# Altium project LoRa_MIET.PrjPcb
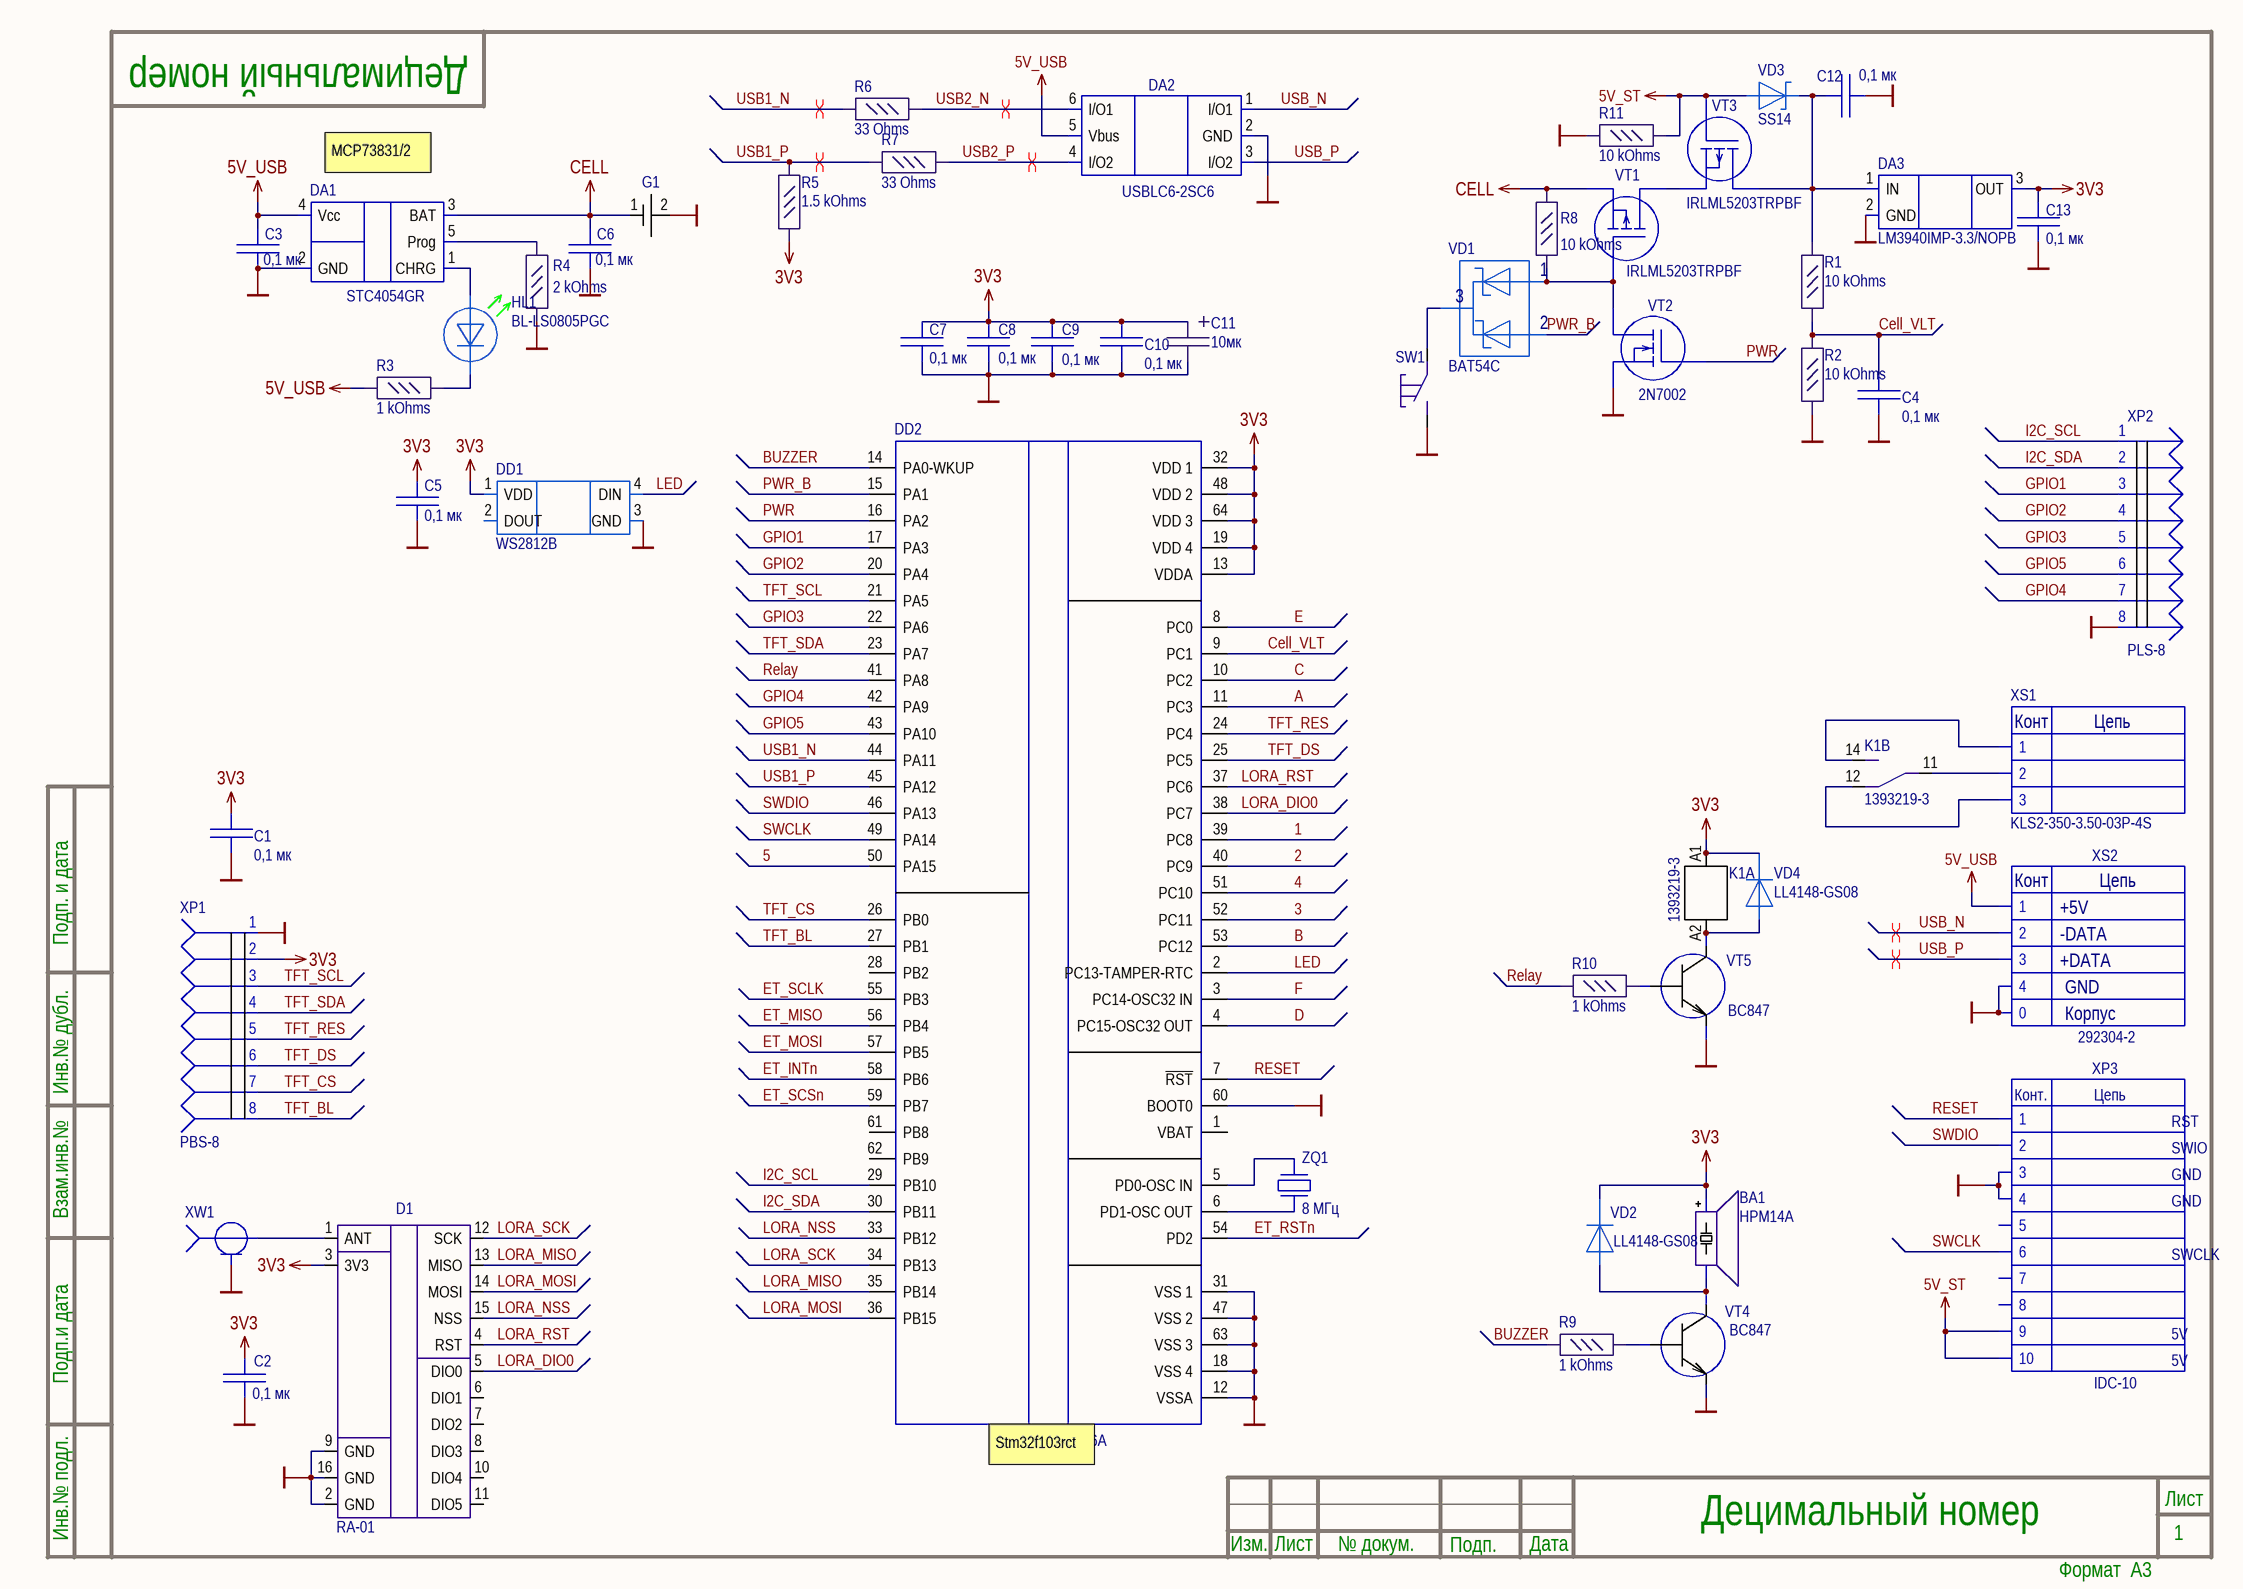
[diagram p0: LoRa_PCB.SchDoc]
2 sheets, 117 parts. Net scope: global (net labels, ports and power ports of the same name join across sheets).
Board file: LoRa_PCB.PcbDoc
Sheets:
  LoRa_PCB.SchDoc
  Sheet1.SchDoc

## Sheet LoRa_PCB.SchDoc: Наименование
size 420 x 297 mm; ApprovedBy: Утвердил; CheckedBy: Проверил; Author: Разработал; CompanyName: Организация; DrawnBy: Н.Контр; Engineer: Т.Контр; SheetNumber: 1; SheetTotal: 1; PageSetup: Record=PageOptions|CenterHorizontal=True|CenterVertical=True|PrintScale=0.94|XCorrection=1.00|YCorrection=1.00|PrintKind=1|BorderSize=5000000|LeftOffset=0|BottomOffset=0|Orientation=1|PaperLength=1000|PaperWidth=1000|Scale=100|PaperSource=7|PrintQuality=-4|MediaType=1|DitherType=10|PaperKind=A4|PrintScaleMode=1; DecimalNumber: Децимальный номер; HeadOfSector: Нач. сектора; MainDevice: Перв.примен.; Name: Наименование; DocumentName: Sheet1.SCHDOC

### Parts
BA1  HPM14A  [HPM14A]
C1  0,1 мк  [C_0805]
C2  0,1 мк  [C_0805]
C3  0,1 мк  [C_0805]
C4  0,1 мк  [C_0805]
C5  0,1 мк  [C_0805]
C6  0,1 мк  [C_0805]
C7  0,1 мк  [C_0805]
C8  0,1 мк  [C_0805]
C9  0,1 мк  [C_0805]
C10  0,1 мк  [C_0805]
C11  10мк  [D_CASE]
C12  0,1 мк  [C_0805]
C13  0,1 мк  [C_0805]
D1  RA-01  [RA-02]
DA1  STC4054GR  [TSOT23-5L]
DA2  USBLC6-2SC6  [SOT-23-6]
DA3  LM3940IMP-3.3/NOPB  [SOT223]
DD1  WS2812B  [WS2812B]
DD2  STM32F103R6T6A  [LQFP64]
G1  12BHC186P1-GR  [12BHC186P1-GR]  (value not drawn)
HL1  BL-LS0805PGC  [LED_0805_GREEN]
K1  1393219-3  [1393219-3]  (parts A,B of 2)
R1  10 kOhms  [R_0805]
R2  10 kOhms  [R_0805]
R3  1 kOhms  [R_0805]
R4  2 kOhms  [R_0805]
R5  1.5 kOhms  [R_0805]
R6  33 Ohms  [R_0805]
R7  33 Ohms  [R_0805]
R8  10 kOhms  [R_0805]
R9  1 kOhms  [R_0805]
R10  1 kOhms  [R_0805]
R11  10 kOhms  [R_0805]
SW1  KLS7-TS6604  [KLS7-TS6604-5.0-180-B]  (value not drawn)
VD1  BAT54C  [SOT23]
VD2  LL4148-GS08  [SOD-80]
VD3  SS14  [DO-214AC]
VD4  LL4148-GS08  [SOD-80]
VT1  IRLML5203TRPBF  [SOT23]
VT2  2N7002  [SOT23]
VT3  IRLML5203TRPBF  [SOT23]
VT4  BC847  [SOT23]
VT5  BC847  [SOT23]
XP1  PBS-8  [PBS-8]
XP2  PLS-8  [PLS-8]
XP3  IDC-10  [IDC-10]
XS1  KLS2-350-3.50-03P-4S  [KLS2-350-3.50-03P-4S]
XS2  292304-2  [USB-B]
XW1  HYR-1139-RP  [SMA (HYR1139)]  (value not drawn)
ZQ1  8 МГц  [MJ CRYSTAL]

### Nets
3V3: BA1.1 C1.2 C2.2 C5.2 C7.2 C8.2 C9.2 C10.2 C11.1 C13.2 D1.3(3V3) DA3.3(OUT) DD1.1(VDD) DD2.13(VDDA) DD2.19(VDD_4) DD2.32(VDD_1) DD2.48(VDD_2) DD2.64(VDD_3) K1.A1 R5.1 VD2.2 VD4.2 XP1.2
5V_ST: R11.1 VD3.1 VT3.1(G) XP3.9 XP3.10
5V_USB: C3.2 DA1.4(Vcc) DA2.5(Vbus) R3.2 XS2.1
CELL: C6.2 DA1.3(BAT) G1.1 R8.2 VT1.2(S)
GND: C1.1 C2.1 C3.1 C4.1 C5.1 C6.1 C7.1 C8.1 C9.1 C10.1 C11.2 C12.2 C13.1 D1.2(GND) D1.9(GND) D1.16(GND) DA1.2(GND) DA2.2(GND) DA3.2(GND) DD1.3(GND) DD2.12(VSSA) DD2.18(VSS_4) DD2.31(VSS_1) DD2.47(VSS_2) DD2.60(BOOT0) DD2.63(VSS_3) G1.2 R2.2 R4.1 R11.2 SW1.1 VT2.2(S) VT4.2(E) VT5.2(E) XP1.1 XP2.8 XP3.3 XP3.4 XS2.0 XS2.4 XW1.1
1: DD2.39(PC8)
2: DD2.40(PC9)
3: DD2.52(PC11)
4: DD2.51(PC10)
5: DD2.50(PA15)
A: DD2.11(PC3)
B: DD2.53(PC12)
BUZZER: DD2.14(PA0-WKUP) R9.2
C: DD2.10(PC2)
Cell_VLT: C4.2 DD2.9(PC1) R1.2 R2.1
D: DD2.4(PC15-OSC32_OUT)
E: DD2.8(PC0)
ET_INTn: DD2.58(PB6)
ET_MISO: DD2.56(PB4)
ET_MOSI: DD2.57(PB5)
ET_RSTn: DD2.54(PD2)
ET_SCLK: DD2.55(PB3)
ET_SCSn: DD2.59(PB7)
F: DD2.3(PC14-OSC32_IN)
GPIO1: DD2.17(PA3) XP2.3
GPIO2: DD2.20(PA4) XP2.4
GPIO3: DD2.22(PA6) XP2.5
GPIO4: DD2.42(PA9) XP2.7
GPIO5: DD2.43(PA10) XP2.6
I2C_SCL: DD2.29(PB10) XP2.1
I2C_SDA: DD2.30(PB11) XP2.2
LED: DD1.4(DIN) DD2.2(PC13-TAMPER-RTC)
LORA_DIO0: D1.5(DIO0) DD2.38(PC7)
LORA_MISO: D1.13(MISO) DD2.35(PB14)
LORA_MOSI: D1.14(MOSI) DD2.36(PB15)
LORA_NSS: D1.15(NSS) DD2.33(PB12)
LORA_RST: D1.4(RST) DD2.37(PC6)
LORA_SCK: D1.12(SCK) DD2.34(PB13)
PWR: DD2.16(PA2) VT2.1(G)
PWR_B: DD2.15(PA1) VD1.2(C2)
Relay: DD2.41(PA8) R10.2
RESET: DD2.7(~{RST}) XP3.1
SWCLK: DD2.49(PA14) XP3.6
SWDIO: DD2.46(PA13) XP3.2
TFT_BL: DD2.27(PB1) XP1.8
TFT_CS: DD2.26(PB0) XP1.7
TFT_DS: DD2.25(PC5) XP1.6
TFT_RES: DD2.24(PC4) XP1.5
TFT_SCL: DD2.21(PA5) XP1.3
TFT_SDA: DD2.23(PA7) XP1.4
USB1_N: DD2.44(PA11) R6.1
USB1_P: DD2.45(PA12) R5.2 R7.1
USB2_N: DA2.6(I/O1) R6.2
USB2_P: DA2.4(I/O2) R7.2
USB_N: DA2.1(I/O1) XS2.2
USB_P: DA2.3(I/O2) XS2.3
NetBA1_2: BA1.2 VD2.1 VT4.3(C)
NetC12_1: C12.1 DA3.1(IN) R1.1 VD3.2 VT3.3(D)
NetD1_1: D1.1(ANT) XW1.2
NetDA1_1: DA1.1(CHRG) HL1.1
NetDA1_5: DA1.5(Prog) R4.2
NetDD2_5: DD2.5(PD0-OSC_IN) ZQ1.3
NetDD2_6: DD2.6(PD1-OSC_OUT) ZQ1.1
NetHL1_2: HL1.2 R3.1
NetK1_11: K1.11 XS1.2
NetK1_12: K1.12 XS1.3
NetK1_14: K1.14 XS1.1
NetK1_A2: K1.A2 VD4.1 VT5.3(C)
NetR8_1: R8.1 VD1.1(A1) VT1.1(G) VT2.3(D)
NetR9_1: R9.1 VT4.1(B)
NetR10_1: R10.1 VT5.1(B)
NetSW1_2: SW1.2 VD1.3(C1A2)
NetVT1_3: VT1.3(D) VT3.2(S)

Not connected (* = marked no-connect by the designer): D1 6(DIO1) 7(DIO2) 8(DIO3) 10(DIO4) 11(DIO5); DD1 2(DOUT); DD2 1(VBAT) 28(PB2) 61(PB8) 62(PB9); XP3 5 7 8

### Layout directives
differential pair: USB1_N, USB1_P, USB2_N, USB2_P, USB_N, USB_P

### Notes on the sheet
- (near DA1) MCP73831/2
- RST
- SWIO
- GND
- SWCLK
- 5V
- (near DD2) Stm32f103rct
- Подп. и дата
- Инв.№ дубл.
- Взам.инв.№
- Подп.и дата
- Инв.№ подл.
- Изм.
- Лист
- № докум.
- Подп.
- Дата
- Формат  A3
- (in symbol 292304-2) Конт; Цепь; +5V; -DATA; +DATA; GND; Корпус
- (in symbol IDC-10) Конт.; Цепь
- (in symbol KLS2-350-3.50-03P-4S) Конт; Цепь

### Library data of the parts
C1-C10 C12 C13 = C_0805
C11 = T491D106K035AT: CAP TANT 10UF 10% 35V 2917; Manufacturer: KEMET; Value: 10µF; Part Number: T491D106K035AT; ComponentLink1URL: https://api.kemet.com/component-edge/download/datasheet/T491D106K035AT.pdf; ComponentLink1Description: Datasheet; Component Type: Tantalum Capacitor
D1 = RA-01: LoRa modem
DA1 = STC4054GR: Контроллер заряда Lion батарей
DA3 = LM3940IMP-3.3/NOPB: Регулятор с малым падением напряжения, преобразование 5В в 3.3В/ 1А
DD2 = STM32F103R6T6A: 32-Bit 72MHz 32KB (32K x 8) FLASH 64-LQFP
G1 = 12BHC186P1-GR: Батарейный отсек 1x18650
K1 = 1393219-3: Реле 5VDC
R1 R2 R8 R11 = CR0805-FX-1002ELF: RES SMD 10K OHM 1% 1/8W 0805; Manufacturer: Bourns Inc.; Part Number: CR0805-FX-1002ELF; ComponentLink1URL: https://www.bourns.com/docs/product-datasheets/CRxxxxx.pdf; ComponentLink1Description: Datasheet; Component Type: Resistor
R3 R9 R10 = CR0805-FX-1001ELF: RES SMD 1K OHM 1% 1/8W 0805; Manufacturer: Bourns Inc.; Part Number: CR0805-FX-1001ELF; ComponentLink1URL: https://www.bourns.com/docs/product-datasheets/CRxxxxx.pdf; ComponentLink1Description: Datasheet; Component Type: Resistor
R4 = CR0805-FX-2001ELF: RES SMD 2K OHM 1% 1/8W 0805; Manufacturer: Bourns Inc.; Part Number: CR0805-FX-2001ELF; ComponentLink1URL: https://www.bourns.com/docs/product-datasheets/CRxxxxx.pdf; ComponentLink1Description: Datasheet; Component Type: Resistor
R5 = CR0805-FX-1501ELF: RES SMD 1.5K OHM 1% 1/8W 0805; Manufacturer: Bourns Inc.; Part Number: CR0805-FX-1501ELF; ComponentLink1URL: https://www.bourns.com/docs/product-datasheets/CRxxxxx.pdf; ComponentLink1Description: Datasheet; Component Type: Resistor
R6 R7 = CR0805-FX-33R0ELF: RES SMD 33 OHM 1% 1/8W 0805; Manufacturer: Bourns Inc.; Value: 33; Part Number: CR0805-FX-33R0ELF; ComponentLink1URL: https://www.bourns.com/docs/product-datasheets/CRxxxxx.pdf; ComponentLink1Description: Datasheet; Component Type: Resistor
VD1 = BAT54C: Диод Шоттки, 2 диода, общий катод, 30В, 0.2А [SOT-23] /
VD2 VD4 = LL4148-GS08: Диод
VT1 VT3 = IRLML5203TRPBF: Транзистор, P-канал 30В 3A logic
VT2 = 2N7002: N-ch MFE transistor
XS1 = KLS2-350-3.50-03P-4S: Клеммник, 3-контактный, 3.5мм
ZQ1 = NX5032GA-8MHz
BA1 = HPM14A: HelpURL: https://static.chipdip.ru/lib/243/DOC000243438.pdf
DA2 = USBLC6-2SC6: HelpURL: https://static.chipdip.ru/lib/093/DOC001093117.pdf

## Sheet Sheet1.SchDoc: Наименование
size 420 x 297 mm; ApprovedBy: Утвердил; CheckedBy: Проверил; Author: Разработал; CompanyName: Организация; DrawnBy: Н.Контр; Engineer: Т.Контр; SheetNumber: 1; SheetTotal: 1; PageSetup: Record=PageOptions|CenterHorizontal=True|CenterVertical=True|PrintScale=0.94|XCorrection=1.00|YCorrection=1.00|PrintKind=1|BorderSize=5000000|LeftOffset=0|BottomOffset=0|Orientation=1|PaperLength=1000|PaperWidth=1000|Scale=100|PaperSource=7|PrintQuality=-4|MediaType=1|DitherType=10|PaperKind=A4|PrintScaleMode=1; DecimalNumber: Децимальный номер; HeadOfSector: Нач. сектора; MainDevice: Перв.примен.; Name: Наименование; DocumentName: Sheet1.SCHDOC
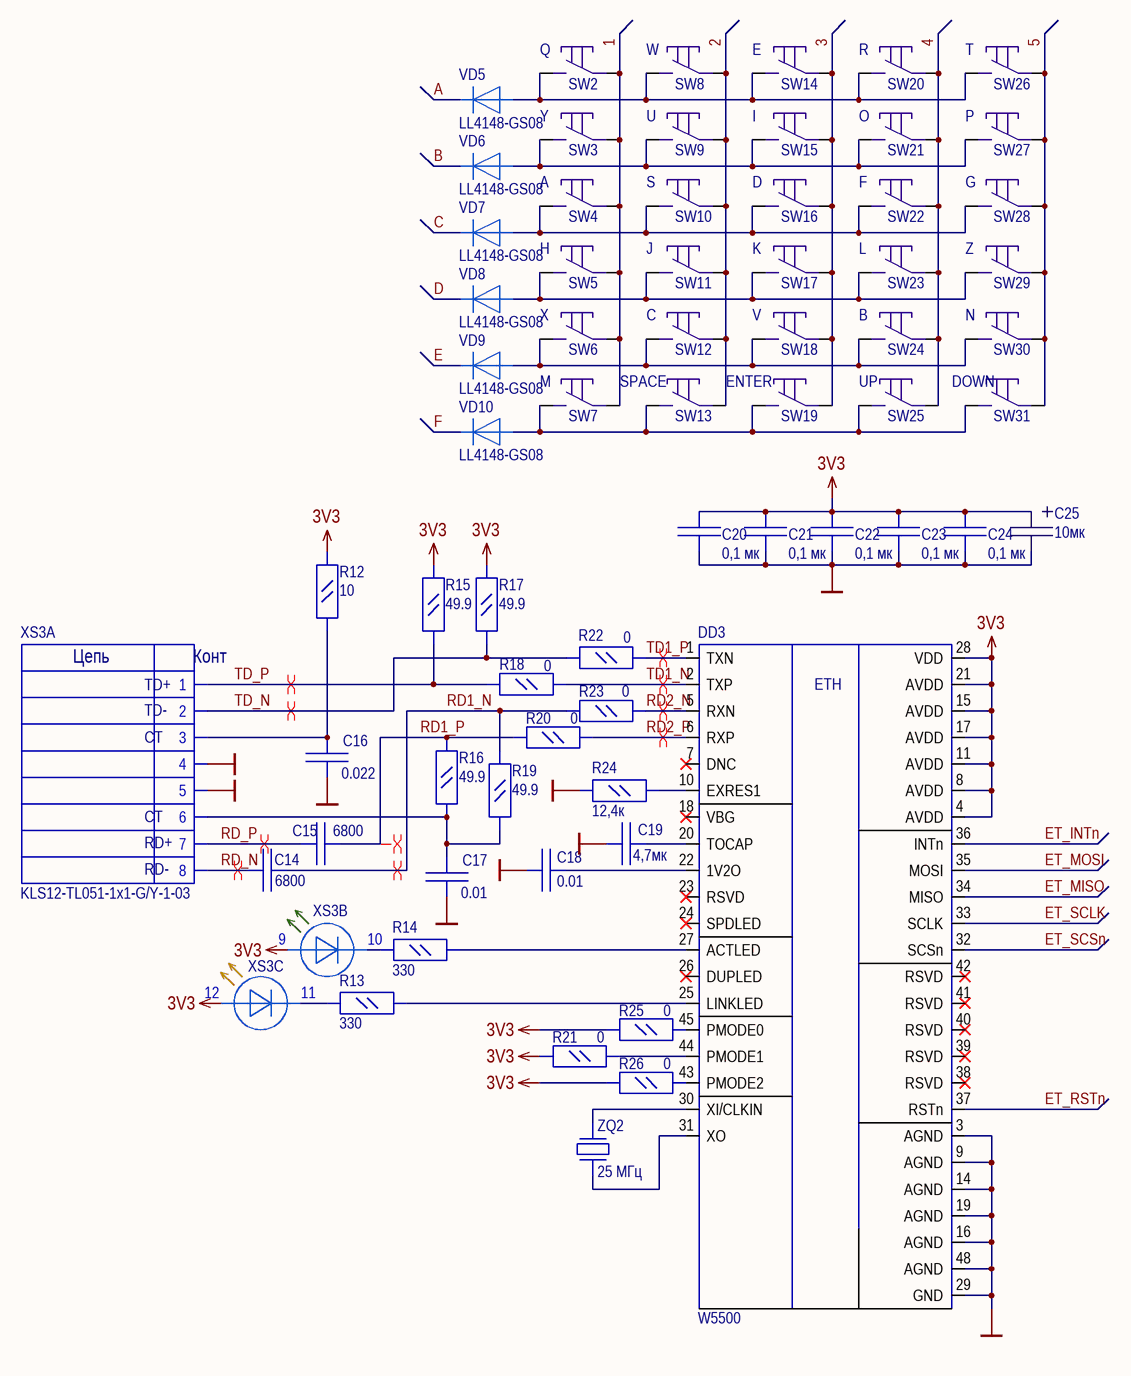
[diagram p1: Sheet1.SchDoc]

### Parts
C14  6800  [C_0805]
C15  6800  [C_0805]
C16  0.022  [C_0805]
C17  0.01  [C_0805]
C18  0.01  [C_0805]
C19  4,7мк  [C_0805]
C20  0,1 мк  [C_0805]
C21  0,1 мк  [C_0805]
C22  0,1 мк  [C_0805]
C23  0,1 мк  [C_0805]
C24  0,1 мк  [C_0805]
C25  10мк  [D_CASE]
DD3  W5500  [LQFP48]
R12  10  [R_0805]
R13  330  [R_0805]
R14  330  [R_0805]
R15  49.9  [R_0805]
R16  49.9  [R_0805]
R17  49.9  [R_0805]
R18  0  [R_0805]
R19  49.9  [R_0805]
R20  0  [R_0805]
R21  0  [R_0805]
R22  0  [R_0805]
R23  0  [R_0805]
R24  12,4к  [R_0805]
R25  0  [R_0805]
R26  0  [R_0805]
SW2  KLS7-TS6604  [KLS7-TS6604-5.0-180-B]  (value not drawn)
SW3  KLS7-TS6604  [KLS7-TS6604-5.0-180-B]  (value not drawn)
SW4  KLS7-TS6604  [KLS7-TS6604-5.0-180-B]  (value not drawn)
SW5  KLS7-TS6604  [KLS7-TS6604-5.0-180-B]  (value not drawn)
SW6  KLS7-TS6604  [KLS7-TS6604-5.0-180-B]  (value not drawn)
SW7  KLS7-TS6604  [KLS7-TS6604-5.0-180-B]  (value not drawn)
SW8  KLS7-TS6604  [KLS7-TS6604-5.0-180-B]  (value not drawn)
SW9  KLS7-TS6604  [KLS7-TS6604-5.0-180-B]  (value not drawn)
SW10  KLS7-TS6604  [KLS7-TS6604-5.0-180-B]  (value not drawn)
SW11  KLS7-TS6604  [KLS7-TS6604-5.0-180-B]  (value not drawn)
SW12  KLS7-TS6604  [KLS7-TS6604-5.0-180-B]  (value not drawn)
SW13  KLS7-TS6604  [KLS7-TS6604-5.0-180-B]  (value not drawn)
SW14  KLS7-TS6604  [KLS7-TS6604-5.0-180-B]  (value not drawn)
SW15  KLS7-TS6604  [KLS7-TS6604-5.0-180-B]  (value not drawn)
SW16  KLS7-TS6604  [KLS7-TS6604-5.0-180-B]  (value not drawn)
SW17  KLS7-TS6604  [KLS7-TS6604-5.0-180-B]  (value not drawn)
SW18  KLS7-TS6604  [KLS7-TS6604-5.0-180-B]  (value not drawn)
SW19  KLS7-TS6604  [KLS7-TS6604-5.0-180-B]  (value not drawn)
SW20  KLS7-TS6604  [KLS7-TS6604-5.0-180-B]  (value not drawn)
SW21  KLS7-TS6604  [KLS7-TS6604-5.0-180-B]  (value not drawn)
SW22  KLS7-TS6604  [KLS7-TS6604-5.0-180-B]  (value not drawn)
SW23  KLS7-TS6604  [KLS7-TS6604-5.0-180-B]  (value not drawn)
SW24  KLS7-TS6604  [KLS7-TS6604-5.0-180-B]  (value not drawn)
SW25  KLS7-TS6604  [KLS7-TS6604-5.0-180-B]  (value not drawn)
SW26  KLS7-TS6604  [KLS7-TS6604-5.0-180-B]  (value not drawn)
SW27  KLS7-TS6604  [KLS7-TS6604-5.0-180-B]  (value not drawn)
SW28  KLS7-TS6604  [KLS7-TS6604-5.0-180-B]  (value not drawn)
SW29  KLS7-TS6604  [KLS7-TS6604-5.0-180-B]  (value not drawn)
SW30  KLS7-TS6604  [KLS7-TS6604-5.0-180-B]  (value not drawn)
SW31  KLS7-TS6604  [KLS7-TS6604-5.0-180-B]  (value not drawn)
VD5  LL4148-GS08  [SOD-80]
VD6  LL4148-GS08  [SOD-80]
VD7  LL4148-GS08  [SOD-80]
VD8  LL4148-GS08  [SOD-80]
VD9  LL4148-GS08  [SOD-80]
VD10  LL4148-GS08  [SOD-80]
XS3  KLS12-TL051-1x1-G/Y-1-03  [KLS12-TL051]  (parts A,B,C of 3)
ZQ2  25 МГц  [MQ CRYSTAL]

### Nets
3V3: C20.2 C21.2 C22.2 C23.2 C24.2 C25.1 DD3.4(AVDD) DD3.8(AVDD) DD3.11(AVDD) DD3.15(AVDD) DD3.17(AVDD) DD3.21(AVDD) DD3.28(VDD) R12.2 R15.2 R17.2 R21.1 R25.1 R26.1 XS3.9 XS3.12
GND: C16.1 C17.1 C18.2 C19.2 C20.1 C21.1 C22.1 C23.1 C24.1 C25.2 DD3.3(AGND) DD3.9(AGND) DD3.14(AGND) DD3.16(AGND) DD3.19(AGND) DD3.29(GND) DD3.48(AGND) R24.1 XS3.4 XS3.5
1: SW2.2 SW3.2 SW4.2 SW5.2 SW6.2 SW7.2
2: SW8.2 SW9.2 SW10.2 SW11.2 SW12.2 SW13.2
3: SW14.2 SW15.2 SW16.2 SW17.2 SW18.2 SW19.2
4: SW20.2 SW21.2 SW22.2 SW23.2 SW24.2 SW25.2
5: SW26.2 SW27.2 SW28.2 SW29.2 SW30.2 SW31.2
A: VD5.2
B: VD6.2
C: VD7.2
D: VD8.2
E: VD9.2
ET_INTn: DD3.36(INTn)
ET_MISO: DD3.34(MISO)
ET_MOSI: DD3.35(MOSI)
ET_RSTn: DD3.37(RSTn)
ET_SCLK: DD3.33(SCLK)
ET_SCSn: DD3.32(SCSn)
F: VD10.2
RD1_N: C14.1 R19.2 R23.1
RD1_P: C15.1 R16.2 R20.1
RD2_N: DD3.5(RXN) R23.2
RD2_P: DD3.6(RXP) R20.2
RD_N: C14.2 XS3.8
RD_P: C15.2 XS3.7
TD1_N: DD3.2(TXP) R18.2
TD1_P: DD3.1(TXN) R22.2
TD_N: R17.1 R22.1 XS3.2
TD_P: R15.1 R18.1 XS3.1
NetC16_2: C16.2 R12.1 XS3.3
NetC17_2: C17.2 R16.1 R19.1 XS3.6
NetC18_1: C18.1 DD3.22(1V2O)
NetC19_1: C19.1 DD3.20(TOCAP)
NetDD3_10: DD3.10(EXRES1) R24.2
NetDD3_25: DD3.25(LINKLED) R13.1
NetDD3_27: DD3.27(ACTLED) R14.2
NetDD3_30: DD3.30(XI/CLKIN) ZQ2.1
NetDD3_31: DD3.31(XO) ZQ2.3
NetDD3_43: DD3.43(PMODE2) R26.2
NetDD3_44: DD3.44(PMODE1) R21.2
NetDD3_45: DD3.45(PMODE0) R25.2
NetR13_2: R13.2 XS3.11
NetR14_1: R14.1 XS3.10
NetSW2_1: SW2.1 SW8.1 SW14.1 SW20.1 SW26.1 VD5.1
NetSW3_1: SW3.1 SW9.1 SW15.1 SW21.1 SW27.1 VD6.1
NetSW4_1: SW4.1 SW10.1 SW16.1 SW22.1 SW28.1 VD7.1
NetSW5_1: SW5.1 SW11.1 SW17.1 SW23.1 SW29.1 VD8.1
NetSW6_1: SW6.1 SW12.1 SW18.1 SW24.1 SW30.1 VD9.1
NetSW7_1: SW7.1 SW13.1 SW19.1 SW25.1 SW31.1 VD10.1

Not connected (* = marked no-connect by the designer): DD3 7(DNC)* 18(VBG)* 23(RSVD)* 24(SPDLED)* 26(DUPLED)* 38(RSVD)* 39(RSVD)* 40(RSVD)* 41(RSVD)* 42(RSVD)*

### Layout directives
differential pair: RD1_N, RD1_P, RD2_N, RD2_P, RD_N, RD_P, TD1_N, TD1_P, TD_N, TD_P

### Notes on the sheet
- (near SW2) Q
- (near SW8) W
- (near SW14) E
- (near SW20) R
- (near SW26) T
- (near SW3) Y
- (near SW9) U
- (near SW15) I
- (near SW21) O
- (near SW27) P
- (near SW4) A
- (near SW10) S
- (near SW16) D
- (near SW22) F
- (near SW28) G
- (near SW5) H
- (near SW11) J
- (near SW17) K
- (near SW23) L
- (near SW29) Z
- (near SW6) X
- (near SW12) C
- (near SW18) V
- (near SW24) B
- (near SW30) N
- (near SW7) M
- SPACE
- ENTER
- (near SW25) UP
- (near SW31) DOWN
- Подп. и дата
- Инв.№ дубл.
- Взам.инв.№
- Подп.и дата
- Инв.№ подл.
- Изм.
- Лист
- № докум.
- Подп.
- Дата
- Формат  A3
- (in symbol KLS12-TL051-1x1-G/Y-1-03, part A) Цепь; Конт; TD+; TD-; CT; RD+; RD-
- (in symbol W5500) ETH

### Library data of the parts
C14-C24 = C_0805
C25 = T491D106K035AT: as C11 on sheet LoRa_PCB; Part Number: T491D106K035AT; ComponentLink1URL: https://api.kemet.com/component-edge/download/datasheet/T491D106K035AT.pdf; ComponentLink1Description: Datasheet; Component Type: Tantalum Capacitor
DD3 = W5500: Hardwired TCP/IP embedded Ethernet controller
R12-R26 = R_0805
VD5-VD10 = LL4148-GS08: Диод
XS3 = KLS12-TL051-1x1-G/Y-1-03: TJ16S-8P8C Разъем на плату 8-8 (RJ-45)
ZQ2 = MQ-25.000-18

## Nets that join several sheets
3V3: LoRa_PCB (23 pins), Sheet1 (21 pins)
GND: LoRa_PCB (41 pins), Sheet1 (20 pins)
1: LoRa_PCB (DD2.39), Sheet1 (6 pins)
2: LoRa_PCB (DD2.40), Sheet1 (6 pins)
3: LoRa_PCB (DD2.52), Sheet1 (6 pins)
4: LoRa_PCB (DD2.51), Sheet1 (6 pins)
5: LoRa_PCB (DD2.50), Sheet1 (6 pins)
A: LoRa_PCB (DD2.11), Sheet1 (VD5.2)
B: LoRa_PCB (DD2.53), Sheet1 (VD6.2)
C: LoRa_PCB (DD2.10), Sheet1 (VD7.2)
D: LoRa_PCB (DD2.4), Sheet1 (VD8.2)
E: LoRa_PCB (DD2.8), Sheet1 (VD9.2)
ET_INTn: LoRa_PCB (DD2.58), Sheet1 (DD3.36)
ET_MISO: LoRa_PCB (DD2.56), Sheet1 (DD3.34)
ET_MOSI: LoRa_PCB (DD2.57), Sheet1 (DD3.35)
ET_RSTn: LoRa_PCB (DD2.54), Sheet1 (DD3.37)
ET_SCLK: LoRa_PCB (DD2.55), Sheet1 (DD3.33)
ET_SCSn: LoRa_PCB (DD2.59), Sheet1 (DD3.32)
F: LoRa_PCB (DD2.3), Sheet1 (VD10.2)